# EAGLE design OTR (EAGLE 9.6.2)
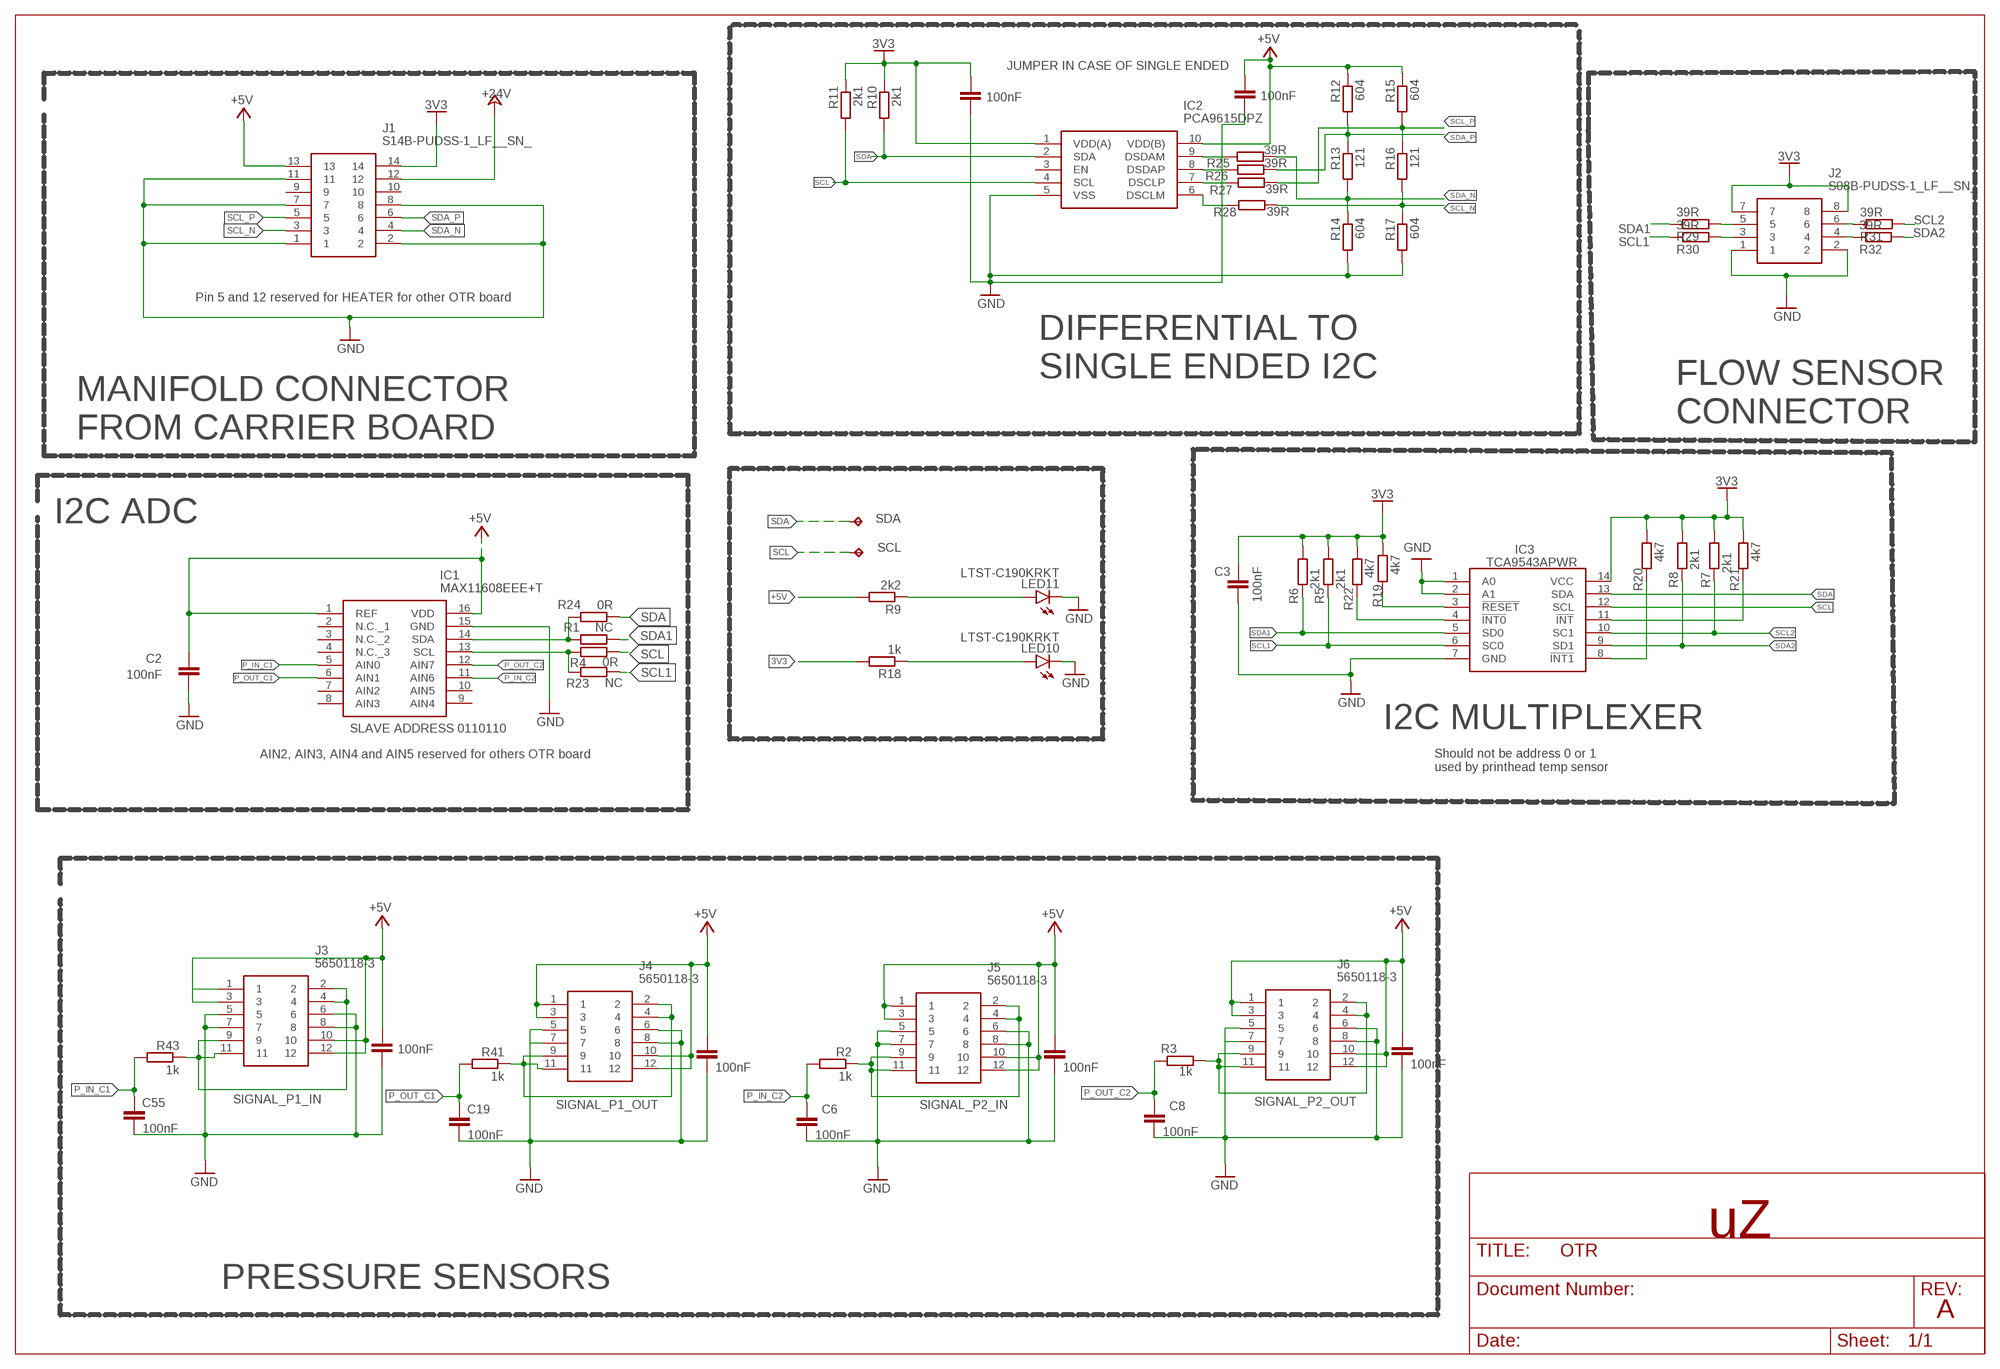
[diagram p0: schematic, sheet 1]

## Parts
C1  100nF  C-EUC0603  [C0603]
C2  100nF  C-EUC0603  [C0603]
C3  100nF  C-EUC0603  [C0603]
C4  100nF  C-EUC0603  [C0603]
C5  100nF  C-EUC0603  [C0603]
C6  100nF  C-EUC0603  [C0603]
C7  100nF  C-EUC0603  [C0603]
C8  100nF  C-EUC0603  [C0603]
C16  100nF  C-EUC0603  [C0603]
C19  100nF  C-EUC0603  [C0603]
C24  100nF  C-EUC0603  [C0603]
C55  100nF  C-EUC0603  [C0603]
IC1  MAX11608EEE+T  [SOP64P602X175-16N]
IC2  PCA9615DPZ  [SOP50P490X110-10N]
IC3  TCA9543APWR  [SOP65P640X120-14N]
J1  S14B-PUDSS-1_LF__SN_  [S14BPUDSS1LFSN]
J2  S08B-PUDSS-1_LF__SN_  [S08B-PUDSS-1_LF__SN_]
J3  5650118-3  [56501183]
J4  5650118-3  [56501183]
J5  5650118-3  [56501183]
J6  5650118-3  [56501183]
LED10  LTST-C190KRKT  LEDCHIPLED_0603  [CHIPLED_0603]
LED11  LTST-C190KRKT  LEDCHIPLED_0603  [CHIPLED_0603]
R1  NC  R-EU_R0603  [R0603]
R2  1k  R-EU_R0603  [R0603]
R3  1k  R-EU_R0603  [R0603]
R4  0R  R-EU_R0603  [R0603]
R5  2k1  R-EU_R0603  [R0603]
R6  2k1  R-EU_R0603  [R0603]
R7  2k1  R-EU_R0603  [R0603]
R8  2k1  R-EU_R0603  [R0603]
R9  2k2  R-EU_R0603  [R0603]
R10  2k1  R-EU_R0603  [R0603]
R11  2k1  R-EU_R0603  [R0603]
R12  604  R-EU_R0603  [R0603]
R13  121  R-EU_R0603  [R0603]
R14  604  R-EU_R0603  [R0603]
R15  604  R-EU_R0603  [R0603]
R16  121  R-EU_R0603  [R0603]
R17  604  R-EU_R0603  [R0603]
R18  1k  R-EU_R0603  [R0603]
R19  4k7  R-EU_R0603  [R0603]
R20  4k7  R-EU_R0603  [R0603]
R21  4k7  R-EU_R0603  [R0603]
R22  4k7  R-EU_R0603  [R0603]
R23  NC  R-EU_R0603  [R0603]
R24  0R  R-EU_R0603  [R0603]
R25  39R  R-EU_R0603  [R0603]
R26  39R  R-EU_R0603  [R0603]
R27  39R  R-EU_R0603  [R0603]
R28  39R  R-EU_R0603  [R0603]
R29  39R  R-EU_R0603  [R0603]
R30  39R  R-EU_R0603  [R0603]
R31  39R  R-EU_R0603  [R0603]
R32  39R  R-EU_R0603  [R0603]
R41  1k  R-EU_R0603  [R0603]
R43  1k  R-EU_R0603  [R0603]
SCL  TEST_POINT  [TEST_POINT]
SDA  TEST_POINT  [TEST_POINT]

## Nets
3V3: C1.1 C3.2 IC2.1(VDD(A)) IC3.14(VCC) J1.14 J2.7 J2.8 R5.1 R6.1 R7.1 R8.1 R10.1 R11.1 R18.2 R19.2 R20.2 R21.2 R22.2
+5V: C2.1 C4.1 C5.1 C7.1 C16.1 C24.1 IC1.1(REF) IC1.16(VDD) IC2.10(VDD(B)) J1.13 J3.1 J3.3 J3.10 J3.12 J4.1 J4.3 J4.10 J4.12 J5.1 J5.3 J5.10 J5.12 J6.1 J6.3 J6.10 J6.12 R9.2 R12.1 R15.1
+24V: J1.12
GND [power]: C1.2 C2.2 C3.1 C4.2 C5.2 C6.2 C7.2 C8.2 C16.2 C19.2 C24.2 C55.2 IC1.15(GND) IC2.5(VSS) IC3.1(A0) IC3.2(A1) IC3.7(GND) J1.1 J1.2 J1.7 J1.8 J1.11 J2.1 J2.2 J3.5 J3.6 J3.7 J3.8 J4.5 J4.6 J4.7 J4.8 J5.5 J5.6 J5.7 J5.8 J6.5 J6.6 J6.7 J6.8 LED10.C LED11.C R14.2 R17.2
N$1: IC3.8(!INT1) R20.1
N$2: IC3.11(!INT) R21.1
N$3: IC3.4(!INT0) R22.1
N$5: LED11.A R9.1
N$7: LED10.A R18.1
N$10: IC3.3(!RESET) R19.1
N$12: IC2.9(DSDAM) R25.1
N$28: J2.5 R29.2
N$44: IC1.14(SDA) R1.2 R24.2
N$45: IC1.13(SCL) R4.2 R23.2
N$46: IC2.8(DSDAP) R26.1
N$47: IC2.7(DSCLP) R27.1
N$48: IC2.6(DSCLM) R28.1
N$49: J2.3 R30.2
N$50: J2.4 R32.1
N$51: J2.6 R31.1
P_IN_C1: C55.1 IC1.5(AIN0) R43.2
P_IN_C2: C6.1 IC1.11(AIN6) R2.2
P_OUT_C1: C19.1 IC1.6(AIN1) R41.2
P_OUT_C2: C8.1 IC1.12(AIN7) R3.2
SCL: IC2.4(SCL) IC3.12(SCL) R4.1 R11.2 SCL.P$1(TP)
SCL1: IC3.6(SC0) R5.2 R23.1 R30.1
SCL2: IC3.10(SC1) R7.2 R31.2
SCL_N: J1.3 R16.2 R17.1 R28.2
SCL_P: J1.5 R15.2 R16.1 R27.2
SDA: IC2.2(SDA) IC3.13(SDA) R10.2 R24.1 SDA.P$1(TP)
SDA1: IC3.5(SD0) R1.1 R6.2 R29.1
SDA2: IC3.9(SD1) R8.2 R32.2
SDA_N: J1.4 R13.2 R14.1 R25.2
SDA_P: J1.6 R12.2 R13.1 R26.2
SIGNAL_P1_IN: J3.2 J3.4 J3.9 J3.11 R43.1
SIGNAL_P1_OUT: J4.2 J4.4 J4.9 J4.11 R41.1
SIGNAL_P2_IN: J5.2 J5.4 J5.9 J5.11 R2.1
SIGNAL_P2_OUT: J6.2 J6.4 J6.9 J6.11 R3.1
Unconnected: IC1.2(N.C._1) IC1.3(N.C._2) IC1.4(N.C._3) IC1.7(AIN2) IC1.8(AIN3) IC1.9(AIN4) IC1.10(AIN5) IC2.3(EN) J1.9 J1.10

## Notes on the sheet
- JUMPER IN CASE OF SINGLE ENDED
- Pin 5 and 12 reserved for HEATER for other OTR board
- DIFFERENTIAL TO
  SINGLE ENDED I2C
- FLOW SENSOR
  CONNECTOR
- MANIFOLD CONNECTOR
  FROM CARRIER BOARD
- I2C ADC
- SLAVE ADDRESS 0110110 | I2C MULTIPLEXER
- AIN2, AIN3, AIN4 and AIN5 reserved for others OTR board
- Should not be address 0 or 1
  used by printhead temp sensor
- uZ
- PRESSURE SENSORS
- A

## Library data of the parts
C1-C8 C16 C19 C24 C55 = rcl:C-EU: CAPACITOR, European symbol; SPICEPREFIX: C
IC1 = MAX11608EEE+T:MAX11608EEE+T: IC, ADC, 10BIT, 94.4KSPS, QSOP-16 Resolution (Bits):10 Sample Rate:94.4kSPS Input Channel Type:Differential, Single Ended Data Interface:Serial, I2C Supply Voltage Range-Analog:2.7V to 3.6V Supply Current:670A Source: Datasheet <http://componentsearchengine.com/Datasheets/1/MAX11608EEE T.pdf>; DESCRIPTION: IC, ADC, 10BIT, 94.4KSPS, QSOP-16 Resolution (Bits):10 Sample Rate:94.4kSPS Input Channel Type:Differential, Single Ended Data Interface:Serial, I2C Supply Voltage Range-Analog:2.7V to 3.6V Supply Current:670A; HEIGHT: 1.75mm; MANUFACTURER_NAME: Analog Devices; MANUFACTURER_PART_NUMBER: MAX11608EEE+T; MOUSER_PART_NUMBER: 700-MAX11608EEE+T; MOUSER_PRICE-STOCK: https://www.mouser.co.uk/ProductDetail/Maxim-Integrated/MAX11608EEE%2bT?qs=d3kjJb5aE2a%252BHG6fkgEQWQ%3D%3D
IC2 = PCA9615DPZ:PCA9615DPZ: Interface - Signal Buffers, Repeaters PCA9615DP Source: Datasheet <https://www.mouser.se/datasheet/2/302/PCA9615-1127690.pdf>; DESCRIPTION: Interface - Signal Buffers, Repeaters PCA9615DP; HEIGHT: 1.1mm; MANUFACTURER_NAME: NXP; MANUFACTURER_PART_NUMBER: PCA9615DPZ; MOUSER_PART_NUMBER: 771-PCA9615DPZ; MOUSER_PRICE-STOCK: https://www.mouser.co.uk/ProductDetail/NXP-Semiconductors/PCA9615DPZ?qs=pBJMDPsKWf3nyRapr7Zy5w%3D%3D
IC3 = TCA9543APWR:TCA9543APWR: 2-Channel I2C Bus Switch With Interrupt Logic and Reset Source: Datasheet <http://www.ti.com/lit/gpn/tca9543a>; DESCRIPTION: 2-Channel I2C Bus Switch With Interrupt Logic and Reset; HEIGHT: 1.2mm; MANUFACTURER_NAME: Texas Instruments; MANUFACTURER_PART_NUMBER: TCA9543APWR; MOUSER_PART_NUMBER: 595-TCA9543APWR; MOUSER_PRICE-STOCK: https://www.mouser.co.uk/ProductDetail/Texas-Instruments/TCA9543APWR?qs=p08Uhw9w2Fzm36ZpNDVXHw%3D%3D
J1 = S14B-PUDSS-1_LF__SN_:S14B-PUDSS-1_LF__SN_: JST PUD Series, 2mm Pitch 14 Way 2 Row Right Angle PCB Header, Solder Termination, 3A Source: Datasheet <http://uk.rs-online.com/web/p/products/9060199>; DESCRIPTION: JST PUD Series, 2mm Pitch 14 Way 2 Row Right Angle PCB Header, Solder Termination, 3A; HEIGHT: 8.5mm; MANUFACTURER_NAME: JST (JAPAN SOLDERLESS TERMINALS); MANUFACTURER_PART_NUMBER: S14B-PUDSS-1(LF)(SN)
J2 = S08B-PUDSS-1_LF__SN_:S08B-PUDSS-1_LF__SN_: JST PUD Series, 2mm Pitch 14 Way 2 Row Right Angle PCB Header, Solder Termination, 3A Source: Datasheet <http://uk.rs-online.com/web/p/products/9060199>; DESCRIPTION: JST PUD Series, 2mm Pitch 14 Way 2 Row Right Angle PCB Header, Solder Termination, 3A; HEIGHT: 8.5mm; MANUFACTURER_NAME: JST (JAPAN SOLDERLESS TERMINALS); MANUFACTURER_PART_NUMBER: S14B-PUDSS-1(LF)(SN)
J3-J6 = 5650118-3:5650118-3: Body Features: Primary Product Color Black | Configuration Features: Number of Power Positions 12 | Number of Positions 12 | Number of Dual Positions 6 | PCB Mount Orientation Right Angle | Number of Signal Positions 0 | Keying & Polarized Position Locations 0 | Contact Features: Contact Mating Area Plating Material Gold | PCB Contact Termination Area Plating Material Thickness 100 MICIN | Contact Mating Area Plating Material Thickness .76 MICM | PCB Contact Termination Area Plating Material Tin | Contact C Source: Datasheet <https://datasheet.datasheetarchive.com/originals/distributors/Datasheets_SAMA/16baf319d9c026ec9af360a565613fb4.pdf>; ARROW_PART_NUMBER: 5650118-3; ARROW_PRICE-STOCK: https://www.arrow.com/en/products/5650118-3/te-connectivity?utm_currency=USD&region=nac; DESCRIPTION: Body Features: Primary Product Color Black | Configuration Features: Number of Power Positions 12 | Number of Positions 12 | Number of Dual Positions 6 | PCB Mount Orientation Right Angle | Number of Signal Positions 0 | Keying & Polarized Position Locations 0 | Contact Features: Contact Mating Area Plating Material Gold | PCB Contact Termination Area Plating Material Thickness 100 MICIN | Contact Mating Area Plating Material Thickness .76 MICM | PCB Contact Termination Area Plating Material Tin | Contact C; HEIGHT: 9.48mm; MANUFACTURER_NAME: TE Connectivity; MANUFACTURER_PART_NUMBER: 5650118-3; MOUSER_PART_NUMBER: 571-5650118-3; MOUSER_PRICE-STOCK: https://www.mouser.co.uk/ProductDetail/TE-Connectivity/5650118-3?qs=00VrTUkr5sBqDKE2vX0kgg%3D%3D
LED10 LED11 = led:LED: LED OSRAM: - CHIPLED LG R971, LG N971, LY N971, LG Q971, LY Q971, LO R971, LY R971 LH N974, LH R974 LS Q976, LO Q976, LY Q976 LO Q996 - Hyper CHIPLED LW Q18S LB Q993, LB Q99A, LB R99A - SideLED LS A670, LO A670, LY A670, LG A670, LP A670 LB A673, LV A673, LT A673, LW A673 LH A674 LY A675 LS A676, LA A676, LO A676, LY A676, LW A676 LS A679, LY A679, LG A679 - Hyper Micro SIDELED® LS Y876, LA Y876, LO Y876, LY Y876 LT Y87S - SmartLED LW L88C, LW L88S LB L89C, LB L89S, LG L890 LS L89K, LO L89K, LY L89K LS L896, LA L896, LO L896, LY L896 - TOPLED LS T670, LO T670, LY T670, LG T670, LP T670 LSG T670, LSP T670, LSY T670, LOP T670, LYG T670 LG T671, LOG T671, LSG T671 LB T673, LV T673, LT T673, LW T673 LH T674 LS T676, LA T676, LO T676, LY T676, LB T676, LH T676, LSB T676, LW T676 LB T67C, LV T67C, LT T67C, LS T67K, LO T67K, LY T67K, LW E67C LS E67B, LA E67B, LO E67B, LY E67B, LB E67C, LV E67C, LT E67C LW T67C LS T679, LY T679, LG T679 LS T770, LO T770, LY T770, LG T770, LP T770 LB T773, LV T773, LT T773, LW T773 LH T774 LS E675, LA E675, LY E675, LS T675 LS T776, LA T776, LO T776, LY T776, LB T776 LHGB T686 LT T68C, LB T68C - Hyper Mini TOPLED® LB M676 - Mini TOPLED Santana® LG M470 LS M47K, LO M47K, LY M47K Source: http://www.osram.convergy.de LUXEON: - LUMILED® LXK2-PW12-R00, LXK2-PW12-S00, LXK2-PW14-U00, LXK2-PW14-V00 LXK2-PM12-R00, LXK2-PM12-S00, LXK2-PM14-U00 LXK2-PE12-Q00, LXK2-PE12-R00, LXK2-PE12-S00, LXK2-PE14-T00, LXK2-PE14-U00 LXK2-PB12-K00, LXK2-PB12-L00, LXK2-PB12-M00, LXK2-PB14-N00, LXK2-PB14-P00, LXK2-PB14-Q00 LXK2-PR12-L00, LXK2-PR12-M00, LXK2-PR14-Q00, LXK2-PR14-R00 LXK2-PD12-Q00, LXK2-PD12-R00, LXK2-PD12-S00 LXK2-PH12-R00, LXK2-PH12-S00 LXK2-PL12-P00, LXK2-PL12-Q00, LXK2-PL12-R00 Source: www.luxeon.com KINGBRIGHT: KA-3528ASYC Source: www.kingbright.com
R1-R32 R41 R43 = rcl:R-EU_: RESISTOR, European symbol; SPICEPREFIX: R
SCL SDA = testpad:TEST_POINT

## Net classes
0 default: width 0.15 mm
1 power: width 0.2 mm, drill 0.25 mm, clearance 0.15 mm

## Board
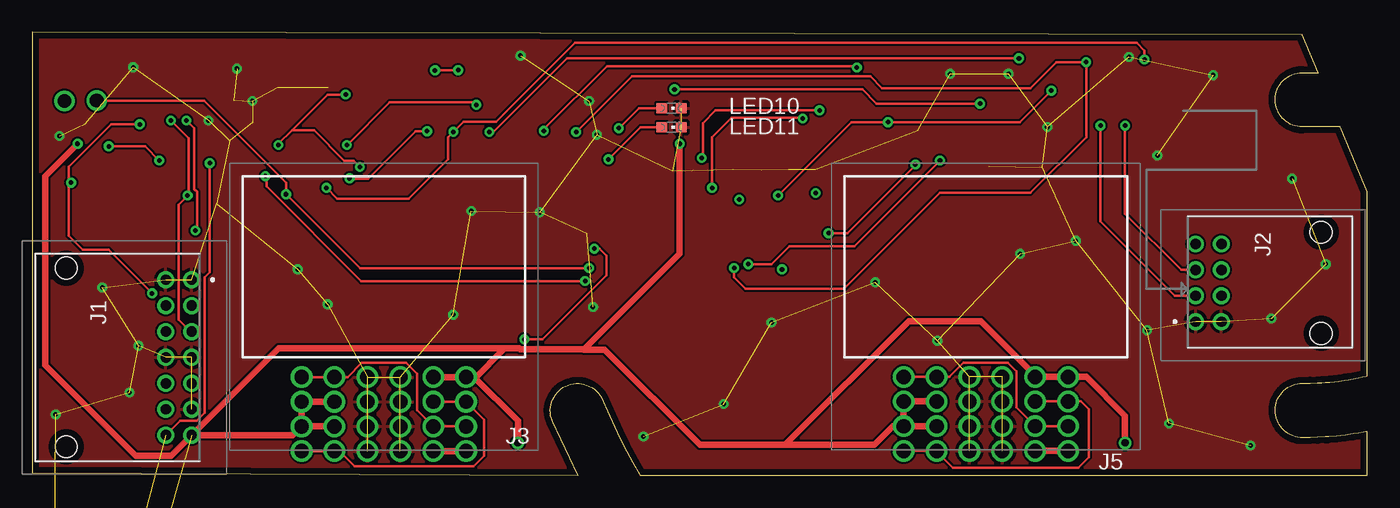
[diagram p1: board, top side]
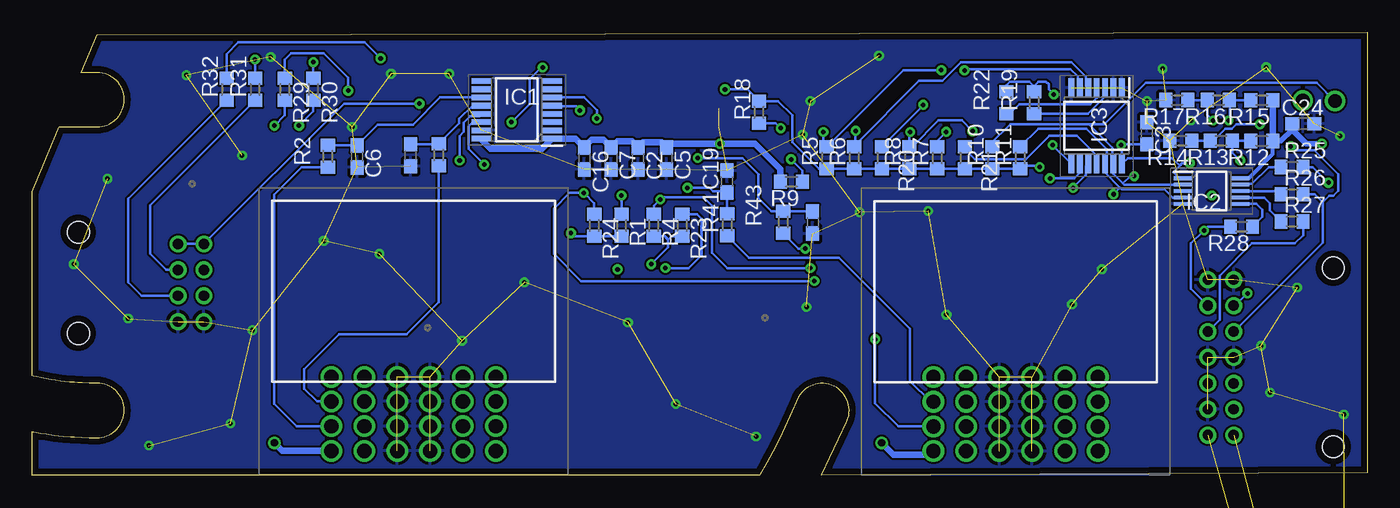
[diagram p2: board, bottom side, seen from below]

Size 103.1 x 34.2 mm. Coordinates in mm from the lower left corner, seen from the top.
Outline: 0,0.2 42.14,0 40.17,4.18 40.09,4.39 40.04,4.58 40.01,4.82 40,5.01 40,5.04 arc-148 43.93,6.05 44.57,4.61 45.16,3.33 45.68,2.29 46.36,1 46.92,0 103.1,0 103.1,3.38 103,3.36 102.79,3.32 102.44,3.26 102.01,3.19 101.41,3.11 100.72,3.03 100.14,2.98 arc-11 99.87,2.96 arc-4 98.12,2.9 arc-90 96,5.02 arc-90 98.08,7.1 98.69,7.11 99.23,7.13 99.6,7.15 99.86,7.17 100.2,7.2 100.59,7.24 100.91,7.28 101.34,7.34 101.66,7.39 102.02,7.45 102.43,7.53 102.77,7.6 103.05,7.66 103.1,7.67 103.1,21.88 101.04,26.9 98.1,26.9 arc-90 96,29 96,29.01 arc-90 98.1,31.1 99.31,31.1 98.1,34 0,34.2 0,0.2
Copper layers (1*16): Top 0.035mm / dielectric 1.5mm / Bottom 0.035mm
Design rules "default *": minimum track width 6mil, minimum drill 0.35mm, track to track 6mil, track to pad 6mil, pad to pad 6mil, via to via 6mil, smd to smd 6mil, copper to edge 0.5mm, drill to drill 6mil, minimum pad ring 10mil, minimum via ring 8mil, stop-mask expansion 4mil, vias tented up to drill 0mil, thermal gap 10mil

### Footprints (pad centres in the part's own frame; a part is rotated, then mirrored left to right if it is on the bottom)
C0603 = smd 1.1 x 1: 1 -0.85,0; 2 0.85,0
SOP64P602X175-16N = smd 1.55 x 0.435: 1 -2.725,2.222; 2 -2.725,1.588; 3 -2.725,0.952; 4 -2.725,0.318; 5 -2.725,-0.318; 6 -2.725,-0.952; 7 -2.725,-1.588; 8 -2.725,-2.222; 9 2.725,-2.222; 10 2.725,-1.588; 11 2.725,-0.952; 12 2.725,-0.318; 13 2.725,0.318; 14 2.725,0.952; 15 2.725,1.588; 16 2.725,2.222
SOP50P490X110-10N = smd 1.4 x 0.3: 1 -2.2,1; 2 -2.2,0.5; 3 -2.2,0; 4 -2.2,-0.5; 5 -2.2,-1; 6 2.2,-1; 7 2.2,-0.5; 8 2.2,0; 9 2.2,0.5; 10 2.2,1
SOP65P640X120-14N = smd 1.475 x 0.45: 1 -2.938,1.95; 2 -2.938,1.3; 3 -2.938,0.65; 4 -2.938,0; 5 -2.938,-0.65; 6 -2.938,-1.3; 7 -2.938,-1.95; 8 2.938,-1.95; 9 2.938,-1.3; 10 2.938,-0.65; 11 2.938,0; 12 2.938,0.65; 13 2.938,1.3; 14 2.938,1.95
S14BPUDSS1LFSN = drill 0.8 pad 1.3: 1 0,0; 2 0,2; 3 -2,0; 4 -2,2; 5 -4,0; 6 -4,2; 7 -6,0; 8 -6,2; 9 -8,0; 10 -8,2; 11 -10,0; 12 -10,2; 13 -12,0; 14 -12,2 | hole 1.7: -12.9,9.7; 0.9,9.7
S08B-PUDSS-1_LF__SN_ = drill 0.8 pad 1.3: 1 0,0; 2 0,2; 3 -2,0; 4 -2,2; 5 -4,0; 6 -4,2; 7 -6,0; 8 -6,2 | hole 1.7: -6.9,9.7; 0.9,9.7
56501183 = drill 1.11 pad 1.665: 1 0,0; 2 0,3.81; 3 2.54,0; 4 2.54,3.81; 5 5.08,0; 6 5.08,3.81; 7 7.62,0; 8 7.62,3.81; 9 10.16,0; 10 10.16,3.81; 11 12.7,0; 12 12.7,3.81
CHIPLED_0603 = smd 0.8 x 0.8: A 0,-0.75; C 0,0.75
R0603 = smd 1 x 1.1: 1 -0.85,0; 2 0.85,0
TEST_POINT = drill 1.05: P$1 0,0

### Placement (x,y rotation side)
C1  0.7,-36.3 0 top  (outside the outline)
C2  56.31,24.46 270 bottom
C3  17.03,26.42 270 bottom
C4  0.7,-41.2 0 top  (outside the outline)
C5  54.13,24.47 270 bottom
C6  78.03,24.62 270 bottom
C7  58.39,24.47 270 bottom
C8  73.89,24.72 270 bottom
C16  60.47,24.47 270 bottom
C19  49.43,22.68 90 bottom
C24  4.94,27.13 0 bottom
C55  42.83,19.52 270 bottom
IC1  65.67,28.22 180 bottom
IC2  12.02,21.95 0 bottom
IC3  20.89,26.98 270 bottom
J1  12.31,15.1 90 top
J2  89.85,11.86 270 top
J3  33.5,7.59 180 top
J4  20.8,5.68 180 bottom
J5  80,7.6 180 top
J6  67.3,5.7 180 bottom
LED10  49.36,28.34 270 top
LED11  49.37,26.87 270 top
R1  57.6,19.3 270 bottom
R2  80.27,24.64 90 bottom
R3  71.71,24.74 90 bottom
R4  55.1,19.3 270 bottom
R5  41.75,24.51 90 bottom
R6  39.62,24.51 90 bottom
R7  33.21,24.51 90 bottom
R8  35.35,24.51 90 bottom
R9  44.47,22.66 180 bottom
R10  28.94,24.51 90 bottom
R11  26.81,24.51 90 bottom
R12  8.14,25.82 180 bottom
R13  11.28,25.83 180 bottom
R14  14.39,25.83 180 bottom
R15  8.14,28.96 180 bottom
R16  11.48,28.97 180 bottom
R17  14.69,28.97 180 bottom
R18  46.97,28.04 90 bottom
R19  25.72,28.76 90 bottom
R20  37.48,24.51 270 bottom
R21  31.08,24.51 270 bottom
R22  27.87,28.76 90 bottom
R23  52.9,19.3 270 bottom
R24  59.7,19.3 270 bottom
R25  5.8,23.8 0 bottom
R26  5.8,21.7 0 bottom
R27  5.8,19.6 0 bottom
R28  9.7,19.2 180 bottom
R29  83.6,29.8 270 bottom
R30  81.4,29.8 270 bottom
R31  85.9,29.8 90 bottom
R32  88.1,29.8 90 bottom
R41  49.43,19.34 90 bottom
R43  45.11,19.55 90 bottom
SCL  4.97,28.93 90 top
SDA  2.49,28.9 90 top
U$1  [LOGO_KT_7/7]  46.51,10.49 0 top

### Tracks (layer width: path | path; a pad name or v marks a point on that pad's centre or on a via)
3V3  (via drill 0.35)  (1 unrouted)
  Top 0.2: v13.7,24.1 13.7,15.67 13.3,15.27 13.3,4.81 12.69,4.19 11.4,4.19 J1.14 | 20.05,26.65 19,25.6 v19,25.5 | 20.05,26.65 22.8,29.4 v24.2,29.4 | v25.3,23.8 24.8,24.3 24.1,24.3 21.75,26.65 20.05,26.65 | v73.2,28.7 65.2,28.7 64.1,29.8 v49.6,29.8
  Bottom 0.2: IC2.1 14.52,22.95 14.98,23.41 14.48,23.91 | 14.48,23.91 15.07,24.5 18.48,24.5 IC3.14 18.94,25.44 v19,25.5 18.93,25.57 C3.2 | v13.7,24.1 14.3,24.1 14.48,23.91 | v24.2,29.4 24.6,29.8 24.6,30.2 24.8,30.4 25.4,30.4 25.72,30.08 R19.2 25.72,30.02 26.1,30.4 27.6,30.4 27.87,30.13 R22.2 | v25.3,23.8 25.4,23.9 26.57,23.9 R11.1 R10.1 R21.2 R7.1 R8.1 R20.2 R6.1 R5.1 42.36,23.66 44.4,25.7 44.4,27.8 45.49,28.89 R18.2 47.88,29.8 v49.6,29.8 | v73.2,28.7 79.01,28.7 J2.7 J2.8
+5V  (via drill 0.35, 0.55)  (1 unrouted)
  Top 0.508: J1.13 10.71,1.5 8,1.5 1.01,8.49 1.01,23.11 v3.5,25.6 | 42.62,9.71 37.67,9.71 37.59,9.8 36.1,9.8 | 42.62,9.71 42.6,9.7 44.2,9.7 51.55,2.35 58.15,2.35 | 36.1,9.8 36.3,9.6 34.29,7.59 J3.1 | 58.15,2.35 67.7,11.9 73.26,11.9 77.46,7.7 J5.3 J5.1 81.4,7.6 84.4,4.6 v84.4,2.5 | 58.15,2.35 65.05,2.35 66.49,3.79 J5.12 | J1.13 19.01,9.8 36.1,9.8 | J3.12 20.12,3.1 J1.13 | J3.12 J3.10 | J4.10 J4.12 | J3.3 J3.1 | J3.12 J4.1 J4.3 | J6.10 J6.12 | J5.12 J6.1 J6.3 | J5.12 J5.10 | J3.1 34.11,7.59 37.5,4.2 v37.5,2.5 | v50,25.6 50,17.1 42.62,9.71
  Bottom 0.305: IC2.10 9.15,22.95 7.29,24.81 R12.1
  Bottom 0.406: v3.5,25.6 4.7,25.6 5.79,26.69 | C24.1 5.79,26.69 | 5.79,26.69 6.66,25.82 R12.1
  Bottom 0.508: R15.1 R12.1 | IC1.16 68.39,25.89 67.7,25.2 63.74,25.2 IC1.1 61.15,26 C16.1 59.89,25.9 58.97,25.9 C7.1 57.91,25.8 56.8,25.8 C2.1 55.92,25.7 54.51,25.7 C5.1 53.85,25.6 v50,25.6 47.3,25.6 45.32,23.62 R9.2 | J6.12 83.79,1.89 v84.4,2.5 | v37.5,2.5 36.6,1.6 33.77,1.6 J4.12
GND  (via drill 0.35)  (80 unrouted)
  other vias: 86.9,24.7 20.5,15.9 22.8,13.2 32.5,12.4 33.9,20.4 39.2,20.3 43.3,13 53.4,5.5 57.1,11.8 47.2,3 87.8,4 94.1,2.3 95.7,12.1 99.9,16.3 86.1,11.2 97.3,22.9 80.6,18.1 76.3,17.1 65.1,14.9 91.2,30.9 84.7,32.3 75.4,31 70.9,31 43,28.9 37.7,32.4 15.8,31.4 7.8,31.5 2.1,26.2 5.4,14.5 8.2,10 7.5,6.4 1.8,4.7 78.4,26.9 43.6,26.3 69.9,10.4 17,28.9 13.6,27.4
  pour Bottom (rank 2): -0.08,34.08 103.03,34.08 103.05,34.1 103.05,22.1 103.06,22.1 103.06,-0.03 48.63,0.02 36.18,0.02 36.14,-0.02 -0.08,-0.02
  pour Top: -0.09,34.1 103.06,34.1 103.06,5.18 103.07,5.03 103.07,-0.04 48.61,0.02 36.15,0.02 36.09,-0.04 -0.09,-0.04
N$1  (via drill 0.35)
  Top 0.2: v34.3,28.61 34.1,28.81 27.61,28.81 v24.3,25.5
  Bottom 0.2: v24.3,25.5 IC3.8 | v34.3,28.61 34.3,28.54 R20.1
N$2
  Bottom 0.2: IC3.11 20.86,24.07 20.86,24.68 22.41,26.23 24.53,26.23 26.35,24.41 30.3,24.41 31.08,25.19 R21.1
N$3
  Bottom 0.2: IC3.4 20.89,29.13 21.36,28.66 26.88,28.66 27.63,27.91 R22.1
N$5  (via drill 0.35)
  Top 0.2: v44.5,24.4 46.97,26.87 LED11.A
  Bottom 0.2: R9.1 43.62,23.52 v44.5,24.4
N$7  (via drill 0.35)
  Top 0.2: v45.3,26.8 46.84,28.34 LED10.A
  Bottom 0.2: R18.1 45.69,27.19 v45.3,26.8
N$10
  Bottom 0.2: IC3.3 20.21,29.89 20.21,29.28 21.58,27.91 R19.1
N$12
  Bottom 0.2: IC2.9 9.77,22.5 8.89,22.5 7.59,23.8 R25.1
N$28  (via drill 0.35)
  Top 0.2: v84.4,27 84.4,20.2 88.74,15.86 J2.5
  Bottom 0.2: R29.2 83.6,27.8 v84.4,27
N$35  (via drill 0.35)
  other vias: 57.9,15.9
N$44  (via drill 0.35)
  Top 0.2: v68.2,24 68.2,23.95 62.95,18.7 v61.5,18.7
  Bottom 0.2: v68.2,24 69.42,25.22 69.42,26.95 69.11,27.27 IC1.14 | R1.2 R24.2 61.25,18.45 v61.5,18.7
N$45  (via drill 0.35)
  Top 0.2: v70.1,24.3 63.5,17.7 58.5,17.7 57.1,16.3 v55.3,16.3
  Bottom 0.2: v70.1,24.3 70.1,26.2 69.78,26.52 69.78,27.24 69.28,27.74 68.56,27.74 IC1.13 | v55.3,16.3 54,17.6 54,18.2 | 54,18.2 54.25,18.45 R4.2 | 54,18.2 53.75,18.45 R23.2
N$46
  Bottom 0.2: IC2.8 6.9,21.95 R26.1
N$47
  Bottom 0.2: R27.1 7.5,20.45 7.5,21 7.95,21.45 IC2.7
N$48
  Bottom 0.2: R28.1 8.1,19.95 8.1,20.5 8.55,20.95 IC2.6
N$49  (via drill 0.35)
  Top 0.2: v82.5,27 82.5,19.6 88.24,13.86 J2.3
  Bottom 0.2: R30.2 81.4,28.1 v82.5,27
N$50
  Bottom 0.2: R32.1 95.7,21.35 95.7,14.9 94.66,13.86 J2.4
N$51
  Bottom 0.2: R31.1 94,20.85 94,17.1 92.76,15.86 J2.6
P_IN_C1  (via drill 0.35)
  Top 0.2: v60.8,28.18 52.78,28.18 51.8,27.2 51.8,24.5 v51.7,24.5
  Bottom 0.2: IC1.5 62.88,28.48 61.1,28.48 v60.8,28.18 | v51.7,24.5 48.27,24.5 47,23.23 47,21.4 46,20.4 R43.2 42.87,20.4 C55.1
P_IN_C2
  Bottom 0.2: R2.2 80.25,25.47 C6.1 76.43,27.07 73.7,27.07 71.59,29.17 IC1.11
P_OUT_C1  (via drill 0.35)
  Top 0.2: v52.5,22.2 52.5,26.1 54,27.6 59.45,27.6 v59.5,27.55
  Bottom 0.2: v52.5,22.2 50.8,22.2 50.53,21.93 49.53,21.93 C19.1 R41.2 | v59.5,27.55 59.5,28.2 60.47,29.17 IC1.6
P_OUT_C2
  Bottom 0.2: C8.1 71.73,25.57 R3.2 70.13,27.17 70.13,27.52 69.11,28.54 69.09,28.54 68.8,28.54 IC1.12
SCL  (via drill 0.35)
  Top 0.2: SCL.P$1 13.27,28.93 19.6,22.6 v19.6,21.7 25.3,16 v43,16
  Bottom 0.2: IC2.4 15.03,21.45 15.67,22.09 18.96,22.09 19.08,22.22 | 19.08,22.22 20.27,23.4 20.27,24.02 IC3.12 20.11,24.17 20.11,25.18 21.69,26.76 25.41,26.76 R11.2 | 19.08,22.22 v19.6,21.7 | v43,16 49.4,16 50.6,17.2 50.6,20.8 51.28,21.48 54.42,21.48 v54.6,21.3 55.1,20.8 R4.1
SCL1  (via drill 0.35)
  Top 0.2: v31.1,31.27 31.12,31.29 v32.89,31.29 | v42,26.5 46.3,30.8 64.73,30.8 65.63,29.9 77.1,29.9 79.1,31.9 v81.4,31.9 81.4,26.1 77.1,21.8 70.1,21.8 62.7,14.4 55.1,14.4 54.2,15.3 v54.2,16
  Bottom 0.2: IC3.6 22.36,30.09 22.36,30.8 22.93,31.37 31,31.37 v31.1,31.27 | v32.89,31.29 35.8,31.29 41.73,25.36 R5.2 42,25.61 v42,26.5 | R23.1 51.75,20.15 51.4,19.8 51.4,17 52.4,16 v54.2,16 | v81.4,31.9 R30.1
SCL2  (via drill 0.35)
  Top 0.2: v22.71,22.2 23.54,21.37 29.07,21.37 32.1,24.4 32.1,26.1 v32.52,26.52 33.3,27.3 35.8,27.3 41.9,33.4 85.3,33.4 85.9,32.8 v85.9,32.1
  Bottom 0.2: IC3.10 21.71,23.87 21.71,23.2 v22.71,22.2 | v32.52,26.52 32.52,26.48 33.21,25.79 R7.2 | v85.9,32.1 R31.2
SCL_N  (via drill 0.35)
  Top 0.2: v11.9,27.4 12.5,26.8 12.5,22.1 12.72,21.88 12.72,19.02 v12.6,18.9
  Bottom 0.2: R17.1 R16.2 12.33,27.83 v11.9,27.4 | J1.3 13.6,14.39 13.6,17.9 v12.6,18.9 12.3,19.2 R28.2
SCL_P  (via drill 0.35)
  Top 0.2: v10.7,27.4 12.09,26.01 12.09,21.7 v11.99,21.6 11.3,20.91 11.3,12 12.2,11.1 J1.5
  Bottom 0.2: R15.2 R16.1 10.62,27.48 v10.7,27.4 | J1.5 11.38,12.03 11.38,15.42 8.9,17.9 5.6,17.9 4.95,18.55 R27.2
SDA  (via drill 0.35)
  Top 0.2: v18,23.1 18.1,23 18.1,22.31 25.41,15 v42.7,15
  Bottom 0.2: 18.86,22.54 19.62,23.3 19.62,24.02 IC3.13 19.66,24.11 19.66,25.28 21.49,27.11 | 18.86,22.54 18.77,22.45 IC2.2 | R10.2 29.13,25.55 27.57,27.11 21.49,27.11 | SDA.P$1 3.89,30.3 17.11,30.3 20.3,27.11 21.49,27.11 | 18.86,22.54 18.3,23.1 v18,23.1 | v42.7,15 60.7,15 62.8,17.1 62.8,20.6 61.6,21.8 v60.5,21.8 59.7,21 R24.1
SDA1  (via drill 0.35)
  Top 0.2: v39.5,26.6 39.5,26.71 44.38,31.59 63.59,31.59 v63.69,31.49 | v57.6,21.6 63.27,27.27 v66.09,27.27 76.27,27.27 v78.7,29.7
  Bottom 0.2: IC3.5 21.71,30.09 21.71,30.76 22.85,31.9 31.38,31.9 32.82,30.46 34.62,30.46 39.62,25.46 R6.2 39.52,25.46 39.52,26.58 v39.5,26.6 | v66.09,27.27 64.7,28.66 64.7,30.6 63.75,31.55 v63.69,31.49 | R1.1 v57.6,21.6 | v78.7,29.7 78.7,30.7 80.6,32.6 83.1,32.6 83.6,32.1 R29.1
SDA2  (via drill 0.35)
  Top 0.2: v24.5,22.93 24.53,22.9 25.92,22.9 29.59,26.57 v30.49,26.57 | v35.3,26.5 35.6,26.5 41.3,32.2 v76.2,32.2
  Bottom 0.2: IC3.9 22.19,23.34 22.6,22.93 v24.5,22.93 | v30.49,26.57 31.32,27.4 33.1,27.4 35.14,25.36 R8.2 35.35,26.45 v35.3,26.5 | v76.2,32.2 77.42,33.42 87.2,33.42 88.1,32.52 R32.2
SDA_N  (via drill 0.35)
  Top 0.2: v9.25,14.05 5.91,17.4 3.9,17.4 2.81,18.49 2.81,22.41 v3,22.6 2.81,22.79 2.81,23.81 6.1,27.1 v8.3,27.1
  Bottom 0.2: R14.1 R13.2 11.9,25.83 10.96,26.77 10.44,26.77 10.11,27.1 v8.3,27.1 | J1.4 10.21,13.1 v9.25,14.05 | v3,22.6 4.2,23.8 R25.2
SDA_P  (via drill 0.35)
  Top 0.2: v5.9,25.4 8.7,25.4 v9.8,24.3
  Bottom 0.2: R13.1 | R13.1 R12.2 | 3.44,21.1 3.44,17.97 J1.6 | v5.9,25.4 5.6,25.1 4.1,25.1 2.24,23.24 2.24,21.96 2.6,21.6 2.94,21.6 3.44,21.1 | v9.8,24.3 10.42,24.92 R13.1 | 3.44,21.1 4.04,21.7 R26.2
SIGNAL_P1_IN  (via drill 0.35)
  Top 0.2: v43.4,17.5 43.8,17.5 44.33,16.97 44.33,15.44 39.39,10.5 v38,10.5 | J3.11 J3.9 24.35,7.59 25.43,8.67 28.87,8.67 29.7,7.84 29.7,5.04 J3.4 J3.2
  Bottom 0.2: R43.1 43.91,17.5 v43.4,17.5 | v38,10.5 38,5.56 36.22,3.78 J3.2
SIGNAL_P1_OUT
  Top 0.2: J4.9 J4.11 34.9,4.28 34.9,1.5 34.08,0.68 24.9,0.68 23.53,2.06 J4.4 J4.2
  Bottom 0.2: R41.1 47.74,16.8 40.78,16.8 35.3,11.32 35.3,7.28 33.7,5.68 J4.11
SIGNAL_P2_IN
  Top 0.2: J5.11 J5.9 70.85,7.6 71.93,8.68 75.37,8.68 76,8.05 76,5.25 J5.4 J5.2
  Bottom 0.2: R2.1 82.29,23.79 84.43,21.65 84.43,5.53 82.69,3.79 J5.2
SIGNAL_P2_OUT
  Top 0.2: J6.9 J6.11 81,5.7 81.6,5.1 81.6,1.4 80.8,0.6 71.09,0.6 69.8,1.89 | J6.2 69.8,1.89 | 69.8,1.89 J6.4
  Bottom 0.2: R3.1 71.71,13.37 74.18,10.9 79.4,10.9 82.1,8.2 82.1,6.7 81.1,5.7 J6.11

### Text on the board
tDocu: SDA | SCL | 3V3 | 5V | 3V3 3V3 / SDA1 SCL2 / SCL1 SDA2 / GND GND | P1_IN | P2_IN | KT240576C / OTR Board Bicolor | FLOW1 / FLOW2
bDocu: P1_OUT | P2_OUT